# EAGLE design ownduino-metaboard-alt2 (EAGLE 6.1)
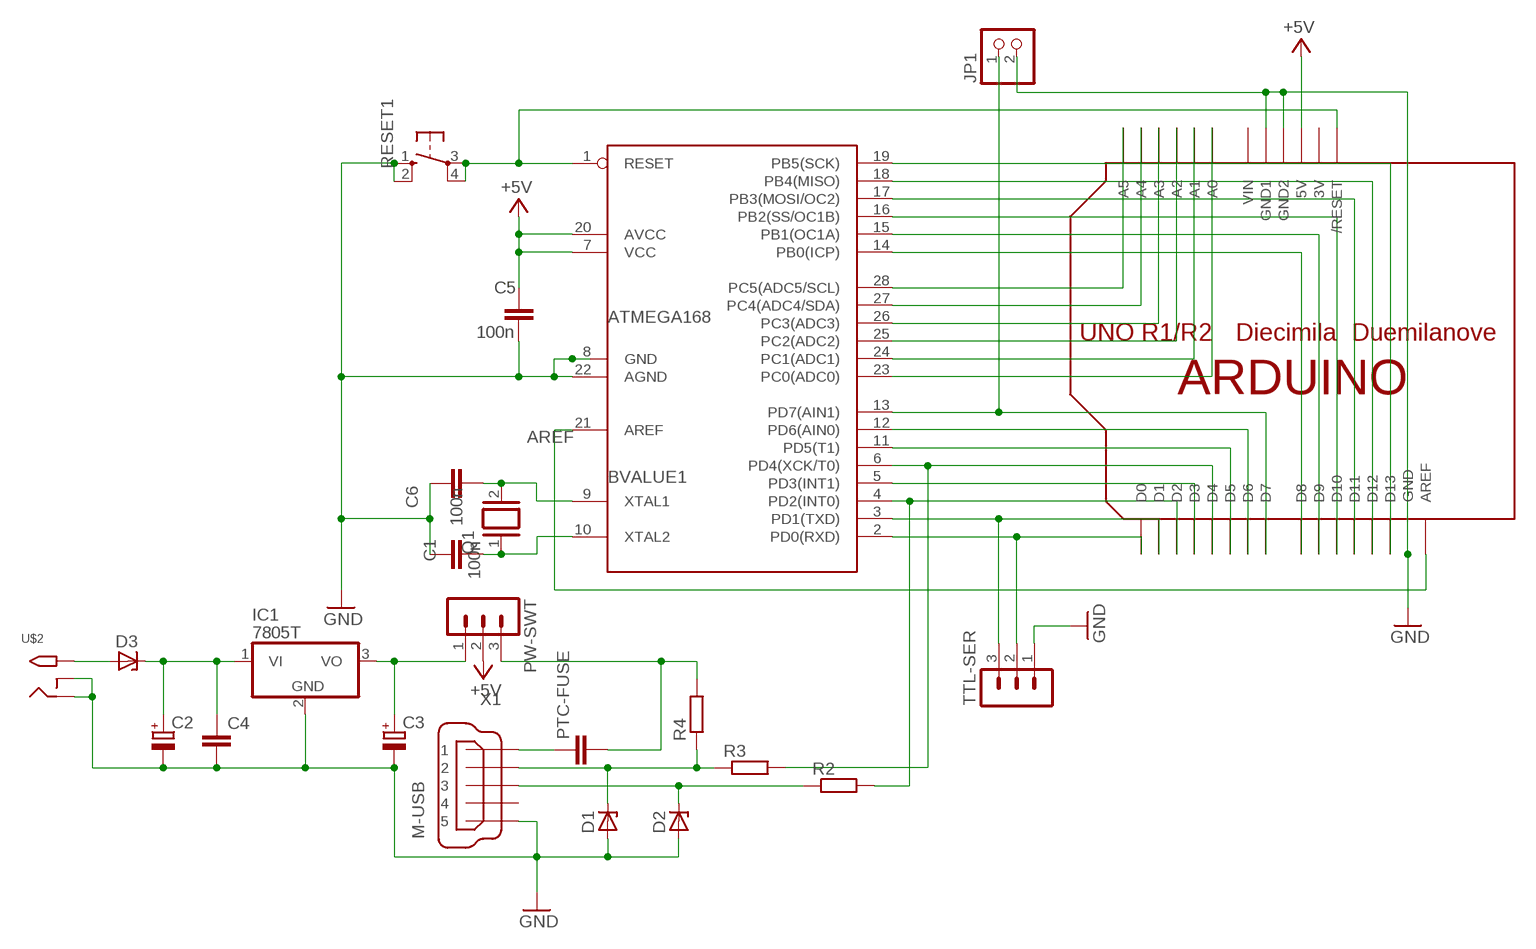
[diagram p0: schematic, sheet 1]

## Parts
BVALUE1  ATMEGA168  MEGA8-P  [DIL28-3]
C1  100n  C-EU025-024X044  [C025-024X044]
C2  CPOL-EUE2.5-6  [E2,5-6]
C3  CPOL-EUE2.5-6  [E2,5-6]
C4  C-EU025-025X050  [C025-025X050]
C5  100n  C-EU025-024X044  [C025-024X044]
C6  100n  C-EU025-024X044  [C025-024X044]
D1  ZENER-DIODEZD-7.5  [ZDIO-7.5]
D2  ZENER-DIODEZD-5  [ZDIO-5]
D3  ZENER-DIODEZD-7.5  [ZDIO-7.5]
IC1  7805T  [TO220H]
JP1  PINHD-1X2  [1X02]
PTC-FUSE  C-EU025_050-025X075  [C025_050-025X075]
PW-SWT  MA03-1  [MA03-1]
Q1  XTAL/S  [QS]
R2  R-EU_0207/12  [0207/12]
R3  R-EU_0207/10  [0207/10]
R4  R-EU_0207/10  [0207/10]
RESET1  10-XX  [B3F-10XX]
TTL-SER  MA03-1  [MA03-1]
U$1  ARDUINOUNO  [ARDUINO]
U$2  2.1MMJACKTHM  [PJ-102A]
X1  M-USB  MINI-USB_SHIELD5P2-32005-601  [32005-601]

## Nets
+5V [power]: BVALUE1.7(VCC) BVALUE1.20(AVCC) C5.1 PW-SWT.2 U$1.5V
A0: BVALUE1.23(PC0(ADC0)) U$1.A0
A1: BVALUE1.24(PC1(ADC1)) U$1.A1
A2: BVALUE1.25(PC2(ADC2)) U$1.A2
A3: BVALUE1.26(PC3(ADC3)) U$1.A3
A4: BVALUE1.27(PC4(ADC4/SDA)) U$1.A4
A5: BVALUE1.28(PC5(ADC5/SCL)) U$1.A5
AREF: BVALUE1.21(AREF) U$1.AREF
D0: BVALUE1.2(PD0(RXD)) TTL-SER.2 U$1.D0
D1: BVALUE1.3(PD1(TXD)) TTL-SER.3 U$1.D1
D2: BVALUE1.4(PD2(INT0)) R2.2 U$1.D2
D3: BVALUE1.5(PD3(INT1)) U$1.D3
D4: BVALUE1.6(PD4(XCK/T0)) R3.2 U$1.D4
D5: BVALUE1.11(PD5(T1)) U$1.D5
D6: BVALUE1.12(PD6(AIN0)) U$1.D6
D7: BVALUE1.13(PD7(AIN1)) JP1.1 U$1.D7
D8: BVALUE1.14(PB0(ICP)) U$1.D8
D9: BVALUE1.15(PB1(OC1A)) U$1.D9
D10: BVALUE1.16(PB2(SS/OC1B)) U$1.D10
D11-MOSI: BVALUE1.17(PB3(MOSI/OC2)) U$1.D11
D12-MISO: BVALUE1.18(PB4(MISO)) U$1.D12
D13-SCK: BVALUE1.19(PB5(SCK)) U$1.D13
D+: D2.C R2.1 X1.3
D-: D1.C R3.1 R4.1 X1.2
GND [power]: BVALUE1.8(GND) BVALUE1.22(AGND) C1.1 C2.- C3.- C4.2 C5.2 C6.1 D1.A D2.A IC1.2(GND) JP1.2 RESET1.1(S) RESET1.2(S1) TTL-SER.1 U$1.GND U$1.GND1 U$1.GND2 U$2.RING U$2.RING_SW X1.5
N$1 [power]: C3.+ IC1.3(VO) PW-SWT.1
N$3: C2.+ C4.1 D3.C IC1.1(VI)
N$4: D3.A U$2.TIP
N$5: BVALUE1.9(XTAL1) C6.2 Q1.2
N$6: BVALUE1.10(XTAL2) C1.2 Q1.1
N$7 [power]: PTC-FUSE.2 PW-SWT.3 R4.2
N$8 [power]: BVALUE1.1(RESET) RESET1.3(P) RESET1.4(P1) U$1.RESET(/RESET)
N$38: PTC-FUSE.1 X1.1
Unconnected: X1.4 X1.M1(S1) X1.M2(S2)

## Power pins joined to a net without a drawn wire
3V: U$1.3V
VIN: U$1.VIN

## Library data of the parts
BVALUE1 = my-library:MEGA8-P: MICROCONTROLLER 8 Kbytes FLASH 1 kbytes SRAM 512 bytes EEPROM USART 4-channel 10 bit ADC 2-channel 8 bit ADC Source: avr.lbr
C1 C4-C6 PTC-FUSE = rcl:C-EU: CAPACITOR, European symbol
C2 C3 = rcl:CPOL-EU: POLARIZED CAPACITOR, European symbol
D1-D3 = diode:ZENER-DIODE: Z-Diode
IC1 = adafruit:78*: Positive VOLTAGE REGULATOR Added bigger pads to the TO-92 package
JP1 = pinhead:PINHD-1X2: PIN HEADER
PW-SWT TTL-SER = con-lstb:MA03-1: PIN HEADER; OC_FARNELL: unknown; OC_NEWARK: unknown
Q1 = special:XTAL/S: CRYSTAL
R2-R4 = rcl:R-EU_: RESISTOR, European symbol
RESET1 = switch-omron:10-XX: OMRON SWITCH
U$1 = adafruit:ARDUINO: Arduino Diecimila/Duemilanove Make a shield with ease, this package has all the named pins as well as the two mounting drill holes and an outline of the USB and DC power connector. The outline is on the DIMENSION layer, so if your board house uses it they will cut the outline to match. http://www.ladyada.net/library/pcb/eaglelibrary.html
U$2 = adafruit:2.1MMJACK: 2.1mm x 5.5mm THM DC jack with internal switch. Digikey part #PJ-102A, 4UCON part #05537 2.1mm x 5.5mm SMT DC jack with internal switch. Digikey part #PJ-002A-SMT, 4UCON part #03267 By microbuilder.eu & adafruit.com
X1 = con-cypressindustries:MINI-USB_SHIELD5P2-: MINI USB-B R/A DIP 5pol. Source: www.cypressindustries.com; OC_FARNELL: unknown; OC_NEWARK: unknown

## Net classes
0 default: width 0.203 mm, clearance 0.203 mm
1 power: width 0.6 mm, clearance 0.305 mm
2 finepitch: width 0.203 mm, clearance 0.203 mm

## Board
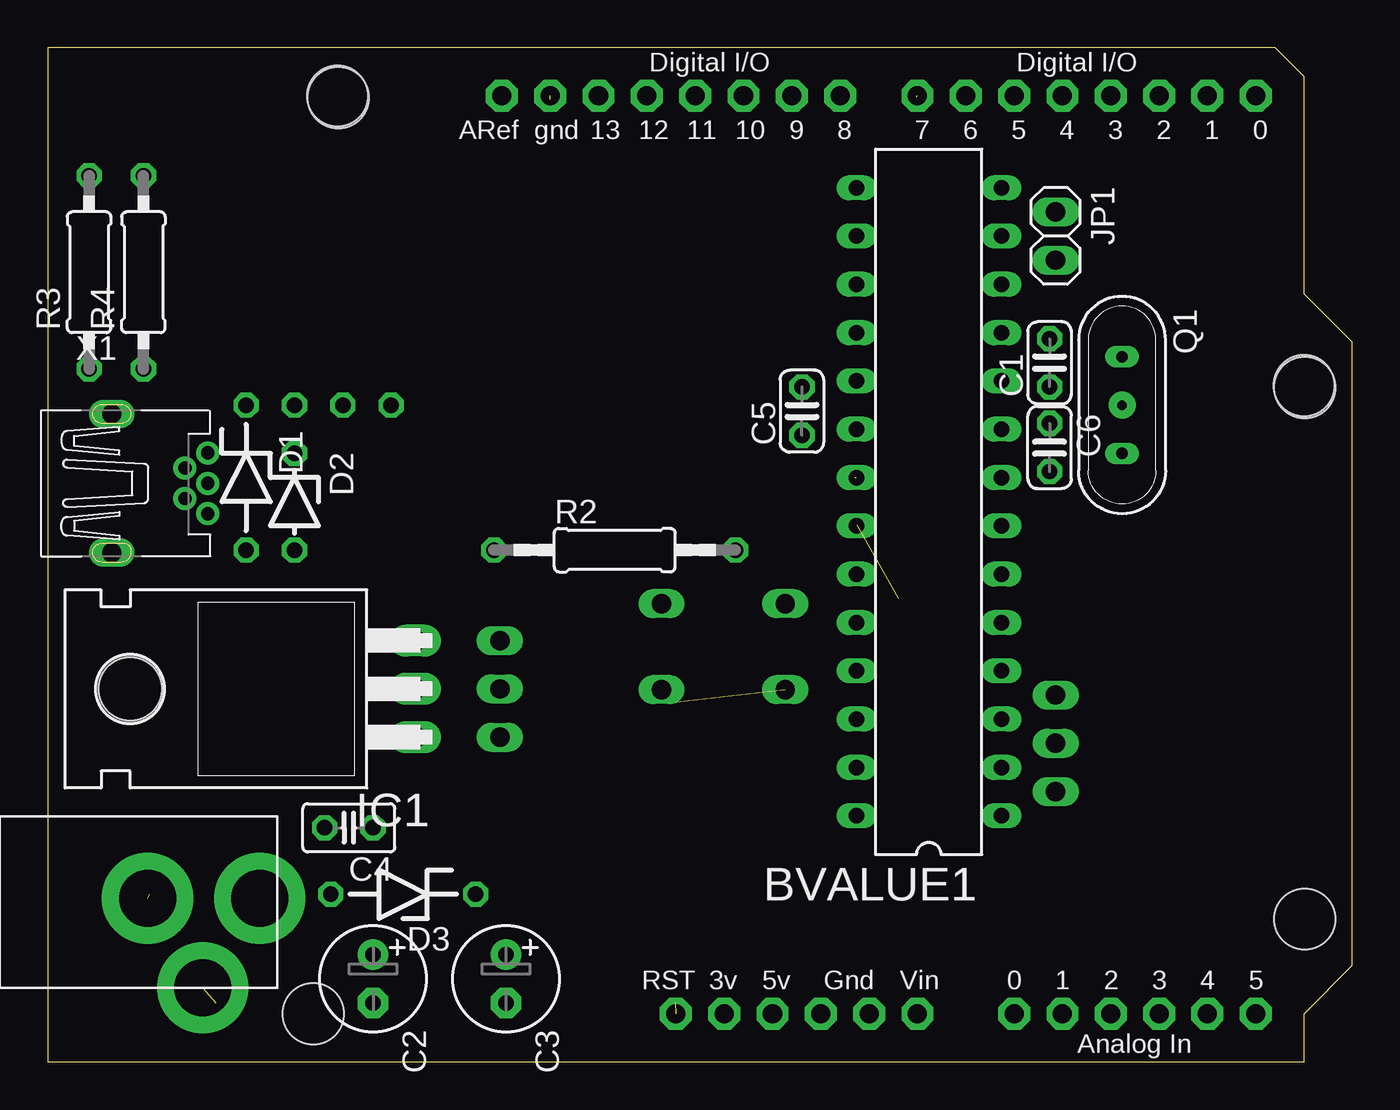
[diagram p1: board, top side]
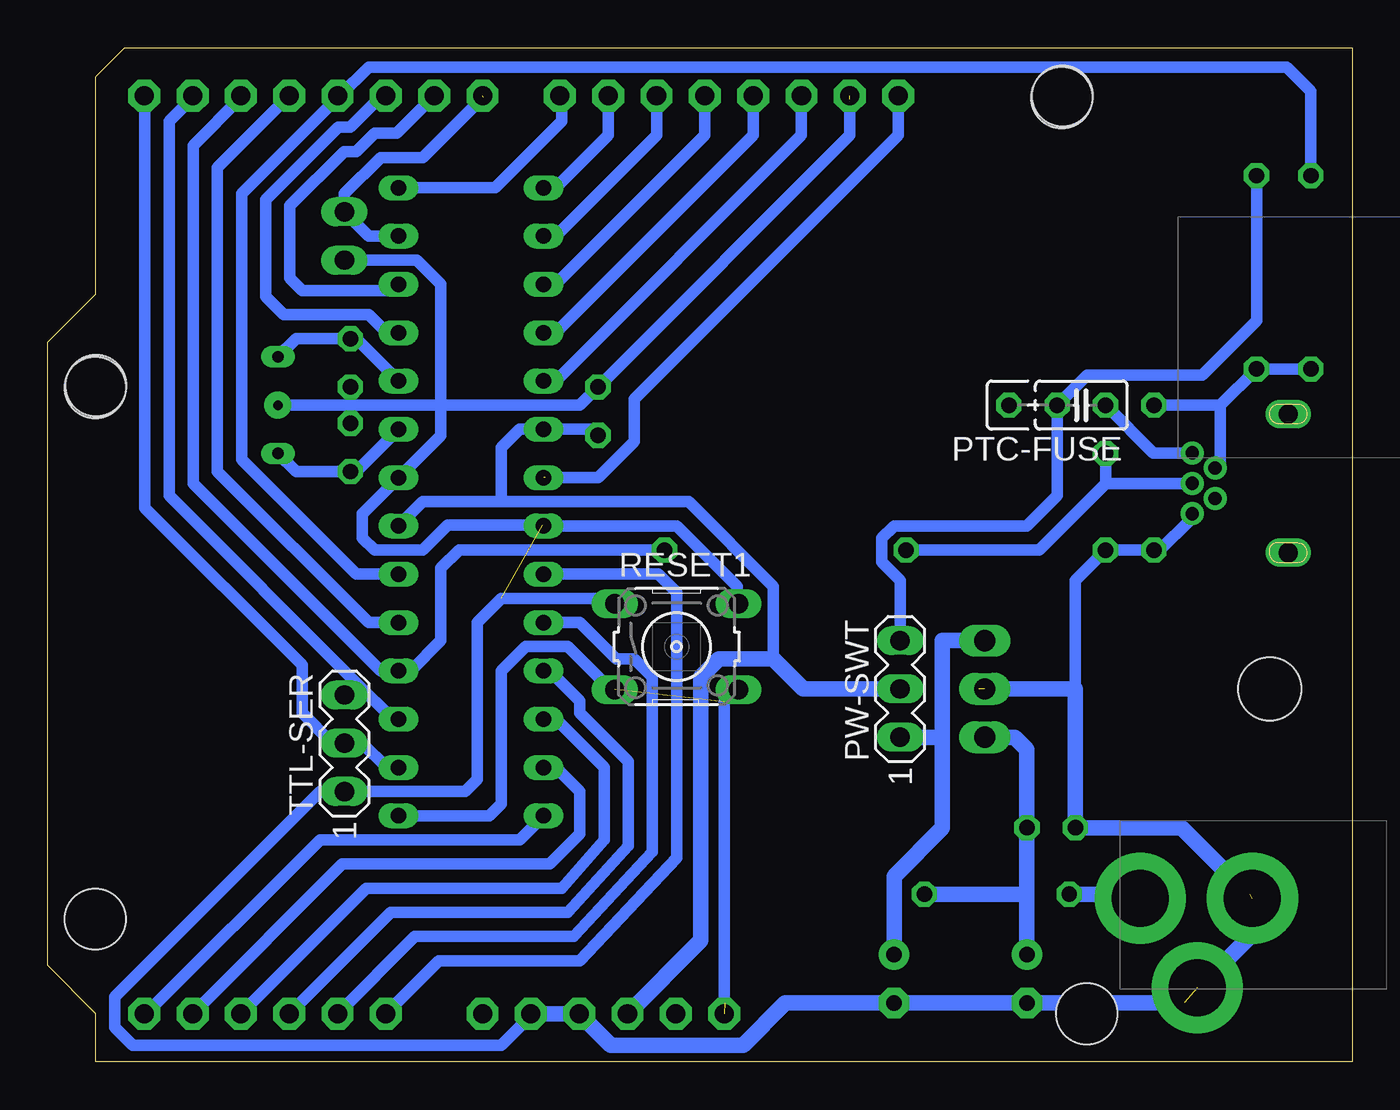
[diagram p2: board, bottom side, seen from below]

Size 68.58 x 53.34 mm. Coordinates in mm from the lower left corner, seen from the top.
Copper layers (1*16): Top 0.035mm / dielectric 1.5mm / Bottom 0.035mm
Design rules: minimum track width 10mil, minimum drill 0.6mm, track to track 8mil, track to pad 8mil, pad to pad 8mil, via to via 12mil, smd to smd 8mil, copper to edge 10mil, drill to drill 15mil, minimum pad ring 10mil, minimum via ring 12mil, stop-mask expansion 4mil, vias tented up to drill 0mil, thermal gap 10mil
Holes 3.2 mm at 66.08,35.46 66.08,7.52 15.28,50.7
tRestrict: area 13.4,48.8 to 17.2,52.6; area 64.2,33.5 to 68,37.3; area 64.2,5.7 to 68,9.4; 10 lines
bRestrict: area 13.4,48.8 to 17.2,52.6; area 64.2,33.5 to 68,37.3; area 64.2,5.7 to 68,9.4; 8 lines

### Footprints (pad centres in the part's own frame; a part is rotated, then mirrored left to right if it is on the bottom)
DIL28-3 = drill 0.813 long: 1 -16.51,-3.81; 2 -13.97,-3.81; 3 -11.43,-3.81; 4 -8.89,-3.81; 5 -6.35,-3.81; 6 -3.81,-3.81; 7 -1.27,-3.81; 8 1.27,-3.81; 9 3.81,-3.81; 10 6.35,-3.81; 11 8.89,-3.81; 12 11.43,-3.81; 13 13.97,-3.81; 14 16.51,-3.81; 15 16.51,3.81; 16 13.97,3.81; 17 11.43,3.81; 18 8.89,3.81; 19 6.35,3.81; 20 3.81,3.81; 21 1.27,3.81; 22 -1.27,3.81; 23 -3.81,3.81; 24 -6.35,3.81; 25 -8.89,3.81; 26 -11.43,3.81; 27 -13.97,3.81; 28 -16.51,3.81
C025-024X044 = drill 0.813 octagon: 1 -1.27,0; 2 1.27,0
E2,5-6 = drill 0.813 pad 1.6: + -1.27,0 | drill 0.813 pad 1.6 octagon: - 1.27,0
C025-025X050 = drill 0.813 octagon: 1 -1.27,0; 2 1.27,0
ZDIO-7.5 = drill 0.813 octagon: A 3.81,0; C -3.81,0
ZDIO-5 = drill 0.813 octagon: A 2.54,0; C -2.54,0
TO220H = drill 1.118 long: 1 -2.54,-10.16; 2 0,-10.16; 3 2.54,-10.16 | hole 3.302: 0,4.826
1X02 = drill 1.016 long: 1 -1.27,0; 2 1.27,0
C025_050-025X075 = drill 0.813 octagon: 1 -1.27,0; 2 1.27,0; 3 3.81,0
MA03-1 = drill 1.016 long: 1 -2.54,0; 2 0,0; 3 2.54,0
QS = drill 0.61 long: 1 -2.54,0; 2 2.54,0
0207/12 = drill 0.813 octagon: 1 -6.35,0; 2 6.35,0
0207/10 = drill 0.813 octagon: 1 -5.08,0; 2 5.08,0
B3F-10XX = drill 1.016 long: 1 -3.251,2.261; 2 3.251,2.261; 3 -3.251,-2.261; 4 3.251,-2.261
ARDUINO = drill 1 pad 1.676 octagon: 3V 35.56,2.54; 5V 38.1,2.54; A0 50.8,2.54; A1 53.34,2.54; A2 55.88,2.54; A3 58.42,2.54; A4 60.96,2.54; A5 63.5,2.54; AREF 23.876,50.8; D0 63.5,50.8; D1 60.96,50.8; D2 58.42,50.8; D3 55.88,50.8; D4 53.34,50.8; D5 50.8,50.8; D6 48.26,50.8; D7 45.72,50.8; D8 41.656,50.8; D9 39.116,50.8; D10 36.576,50.8; D11 34.036,50.8; D12 31.496,50.8; D13 28.956,50.8; GND 26.416,50.8; GND1 43.18,2.54; GND2 40.64,2.54; RESET 33.02,2.54; VIN 45.72,2.54 | hole 3.2: 15.24,50.8; 66.04,35.56; 13.97,2.54
PJ-102A = drill 3 pad 4.8: RING 0.1,-3.39; RING_SW -4.6,-6.29; TIP 0.1,-9.29
32005-601 = drill 0.7 pad 1.016: 1 2.825,1.6; 2 1.625,0.8; 3 2.825,0; 4 1.625,-0.8; 5 2.825,-1.6 | drill 1 pad 1.422 long: M1 -2.225,3.65; M2 -2.225,-3.65

### Placement (x,y rotation side)
BVALUE1  46.32,29.46 90 top
C1  52.67,36.76 90 top
C2  17.11,4.38 270 top
C3  24.09,4.38 270 top
C4  15.84,12.31 180 top
C5  39.65,34.22 90 top
C6  52.67,32.32 270 top
D1  10.44,30.73 270 top
D2  12.98,29.46 270 top
D3  18.69,8.82 180 top
IC1  9.17,19.62 90 top
JP1  52.98,43.43 270 top
PTC-FUSE  14.25,34.54 180 bottom
PW-SWT  23.77,19.62 90 bottom
Q1  56.48,34.54 270 top
R2  29.81,26.92 0 top
R3  2.18,41.52 90 top
R4  5.04,41.52 90 top
RESET1  35.52,21.84 0 bottom
TTL-SER  52.98,16.76 90 bottom
U$1  0,0 0 top
U$2  1.87,8.5 90 top
X1  5.59,30.43 0 top

### Tracks (layer width: path | path; a pad name or v marks a point on that pad's centre or on a via)
+5V
  Bottom 0.61: 44.73,29.46 48.87,29.46 50.13,28.2 BVALUE1.7 | 44.73,29.46 44.73,32.32 43.78,33.27 BVALUE1.20 39.97,33.27 C5.1 | 44.73,29.46 34.89,29.46 30.44,25.01 30.44,21.2
  Bottom 0.813: U$1.5V 34.25,6.39 34.25,20.25 33.3,21.2 30.44,21.2 28.85,19.62 PW-SWT.2
A0
  Bottom 0.61: U$1.A0 48.01,5.33 40.6,5.33 35.52,10.73 35.52,24.7 36.47,25.65 BVALUE1.23
A1
  Bottom 0.61: U$1.A1 49.28,6.6 40.92,6.6 36.79,11.04 36.79,20.25 37.74,21.2 38.7,21.2 40.6,23.11 BVALUE1.24
A2
  Bottom 0.61: U$1.A2 50.55,7.87 41.24,7.87 38.06,11.36 38.06,15.81 40.6,18.35 40.6,18.98 42.19,20.57 BVALUE1.25
A3
  Bottom 0.61: 58.38,2.58 U$1.A3 51.82,9.14 41.55,9.14 39.33,11.68 39.33,15.49 41.87,18.03 BVALUE1.26
A4
  Bottom 0.61: 60.92,2.58 U$1.A4 53.09,10.41 42.19,10.41 40.6,12 40.6,14.22 41.87,15.49 BVALUE1.27
A5
  Bottom 0.61: BVALUE1.28 43.78,11.68 54.25,11.68 63.46,2.47 63.46,2.5 U$1.A5
AREF  (1 unrouted)
  Bottom 0.61: U$1.AREF 23.88,48.72 37.74,34.86 37.74,32.63 39.65,30.73 42.43,30.73
D0
  Bottom 0.61: 63.46,50.41 63.5,50.45 U$1.D0 63.46,50.76 63.46,29.14 55.21,20.89 55.21,18.35 53.62,16.76 TTL-SER.2 52.03,16.76 50.76,15.49 BVALUE1.2
D1
  Bottom 0.61: U$1.D1 60.96,50.69 62.19,49.46 62.19,29.78 52.35,19.93 | 52.35,19.93 50.44,18.03 BVALUE1.3 | TTL-SER.3 52.35,19.93
D2
  Bottom 0.61: R2.2 46.95,26.92 47.9,25.97 47.9,22.16 49.49,20.57 BVALUE1.4 51.08,20.57 60.92,30.41 60.92,48.19 58.42,50.69 U$1.D2
D3
  Bottom 0.61: BVALUE1.5 51.71,23.11 59.65,31.05 59.65,47.03 U$1.D3
D4
  Bottom 0.61: R3.2 2.18,51.05 3.45,52.32 51.71,52.32 53.23,50.8 U$1.D4 53.34,50.69 58.38,45.65 58.38,31.68 52.35,25.65 BVALUE1.6
D5
  Bottom 0.61: U$1.D5 51.01,50.8 52.67,49.14 53.3,49.14 57.11,45.33 57.11,40.25 56.16,39.3 51.71,39.3 50.76,38.35 BVALUE1.11
D6
  Bottom 0.61: U$1.D6 50.23,48.83 51.4,48.83 52.35,47.87 52.98,47.87 55.84,45.02 55.84,41.21 55.21,40.57 50.76,40.57 50.44,40.89 BVALUE1.12
D7  (1 unrouted)
  Bottom 0.61: 45.68,50.73 48.86,47.56 51.08,47.56 52.98,45.65 JP1.1 51.71,43.43 BVALUE1.13
D8
  Bottom 0.61: U$1.D8 41.55,50.7 41.55,49.46 45.05,45.97 BVALUE1.14
D9
  Bottom 0.61: U$1.D9 39.12,48.72 41.87,45.97 BVALUE1.15
D10
  Bottom 0.61: U$1.D10 36.58,48.72 41.87,43.43 BVALUE1.16
D11-MOSI
  Bottom 0.61: U$1.D11 34.04,48.72 41.87,40.89 BVALUE1.17
D12-MISO
  Bottom 0.61: U$1.D12 31.5,48.72 41.87,38.35 BVALUE1.18
D13-SCK
  Bottom 0.61: U$1.D13 28.96,48.72 41.87,35.81 BVALUE1.19
D+
  Bottom 0.61: X1.3 12.96,30.43 | D2.C 12.98,30.44 12.96,30.43 | 12.96,30.43 16.47,26.92 R2.1
D-
  Bottom 0.61: X1.2 6.95,31.5 6.95,34.54 | 6.95,34.54 D1.C | 6.95,34.54 R4.1 R3.1
GND  (via drill 0.5 pad 1.42)  (5 unrouted)
  Bottom 0.61: X1.5 8.53,28.71 8.53,28.51 10.12,26.92 D1.A D2.A 14.57,25.33 14.57,19.62 | 26.42,50.63 26.42,48.72 C5.2 40.6,34.54 47.9,34.54 | 47.9,34.54 47.9,32.95 BVALUE1.8 52.02,28.84 52.03,28.84 52.03,27.55 51.4,26.92 48.86,26.92 47.54,28.23 42.55,28.23 BVALUE1.22 35.52,28.19 32.35,25.01 32.35,24.06 | 47.9,34.54 52.67,34.54 | 52.67,34.54 C1.1 | 52.67,34.54 C6.1 | v56.48,34.54 52.67,34.54 | RESET1.1 38.77,24.14 39.01,24.38 44.73,24.38 46,23.11 46,14.85 46.63,14.22 TTL-SER.1 54.25,14.22 65.05,3.42 65.05,1.84 64.1,0.88 44.73,0.88 43.18,2.43 U$1.GND1 | JP1.2 49.17,42.16 47.9,40.89 47.9,34.54
  Bottom 0.813: 5.36,8.82 5.36,6.6 8.85,3.11 C2.- C3.- 29.81,3.11 32.03,0.88 38.98,0.88 U$1.GND2 U$1.GND1 | U$2.RING 8.97,12.31 C4.2 14.57,19.62 19.65,19.62 | 32.35,24.06 32.31,24.1 RESET1.2
N$1
  Bottom 0.813: IC1.3 21.55,22.16 21.55,17.08 | C3.+ 24.09,9.77 21.55,12.31 21.55,17.08 | PW-SWT.1 21.55,17.08
N$3
  Bottom 0.813: C2.+ 17.11,8.82 | 17.11,8.82 C4.1 17.11,16.44 17.74,17.08 IC1.1 | D3.C 17.11,8.82
N$4
  Bottom 0.813: D3.A 11.37,8.82 U$2.TIP
N$5
  Bottom 0.61: BVALUE1.9 52.35,31.05 C6.2 55.52,31.05 Q1.2
N$6
  Bottom 0.61: BVALUE1.10 52.35,38.03 C1.2 55.52,38.03 Q1.1
N$7
  Bottom 0.61: R4.2 5.04,38.98 7.9,36.13 13.93,36.13 PTC-FUSE.2 15.52,29.78 17.11,28.19 24.09,28.19 24.73,27.55 24.73,26.28 23.77,25.33 PW-SWT.3
N$8  (2 unrouted)
  Bottom 0.406: 32.66,3.11 32.98,3.11
  Bottom 0.61: BVALUE1.1 45.36,12.95 44.73,13.58 44.73,20.57 43.46,21.84 41.24,21.84 38.97,19.58 RESET1.3 | U$1.RESET 33.02,18.94 32.35,19.62
  Bottom 0.813: RESET1.4 32.31,19.62 32.35,19.62
N$38
  Bottom 0.61: X1.1 10.47,32.03 PTC-FUSE.1

### Text on the board
Edit History: 20070917 WestfW: Move (CC) symbol, use silk_gen to get 5mil widths | 20070917 WestfW: Manual route some, autoroute rest. Fiddle. | 20070917 WestfW: Now V1.16. Change components to TH. | 20070911 WestfW: Now V1.15. Move tracks slightly for shielding | 20070900 Daniel: Schematic and initial placement
_tsilk: C12 | C8 | 3 2 1 0 9 8 | 7 6 5 4 3 2 1 0 | RX | TX | 1 1 1 1 | Digital | X2 | AREF | GND | R7 | PWM | PWM | PWM | PWM | PWM | PWM | PWR | IC1 | 13 | Freeduino | FT232RL | c | c | R10 | V1.16 | TX | R8 | RX | 16Mhz | 1 | R1 | R9 | C3 | C10 | R12 | ]USB | R11 | ]EXT | F1 | Q1 | C2 | ICSP | RESET | 1 | CRS | M. Banzi | D. Cuartielles | D. Mellis | N. Zambetti | C5 | C4 | ATMEGA168 | IC2 | D1 | C1 | 47u | C7 | 47u | C6 | C9 | Analog in | 5V Gnd 9V | RESET | 3.3V | 0 1 2 3 4 5 | 9V in